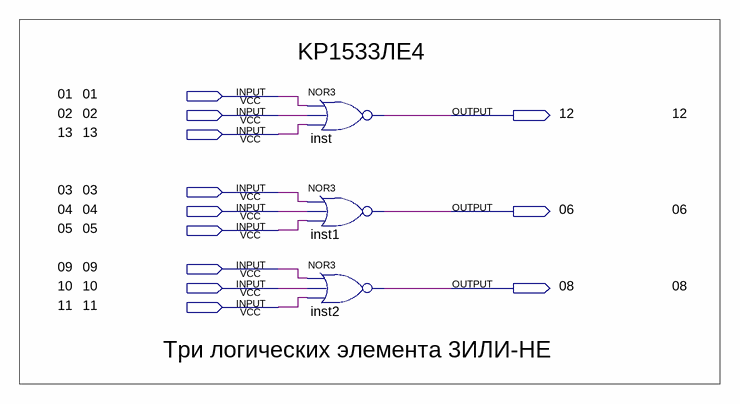
[diagram p0: schematic sheet]
// Quartus schematic KP1533LE4.bdf as structural Verilog: 3 symbols, 12 pins
module KP1533LE4 (
  input  \01 ,
  input  \02 ,
  input  \13 ,
  input  \03 ,
  input  \04 ,
  input  \05 ,
  input  \09 ,
  input  \10 ,
  input  \11 ,
  output \12 ,
  output \06 ,
  output \08 
);

  nor inst (\12 , \01 , \02 , \13 );
  nor inst1 (\06 , \03 , \04 , \05 );
  nor inst2 (\08 , \09 , \10 , \11 );

  // Notes on the sheet:
  //   KP1533ЛЕ4
  //   01
  //   02
  //   12
  //   13
  //   03
  //   04
  //   06
  //   05
  //   09
  //   10
  //   08
  //   11
  //   Три логических элемента 3ИЛИ-НЕ
endmodule
